# Altium project Jetson AGX Xavier Carrier Board.PrjPcb (part 8 of 8)
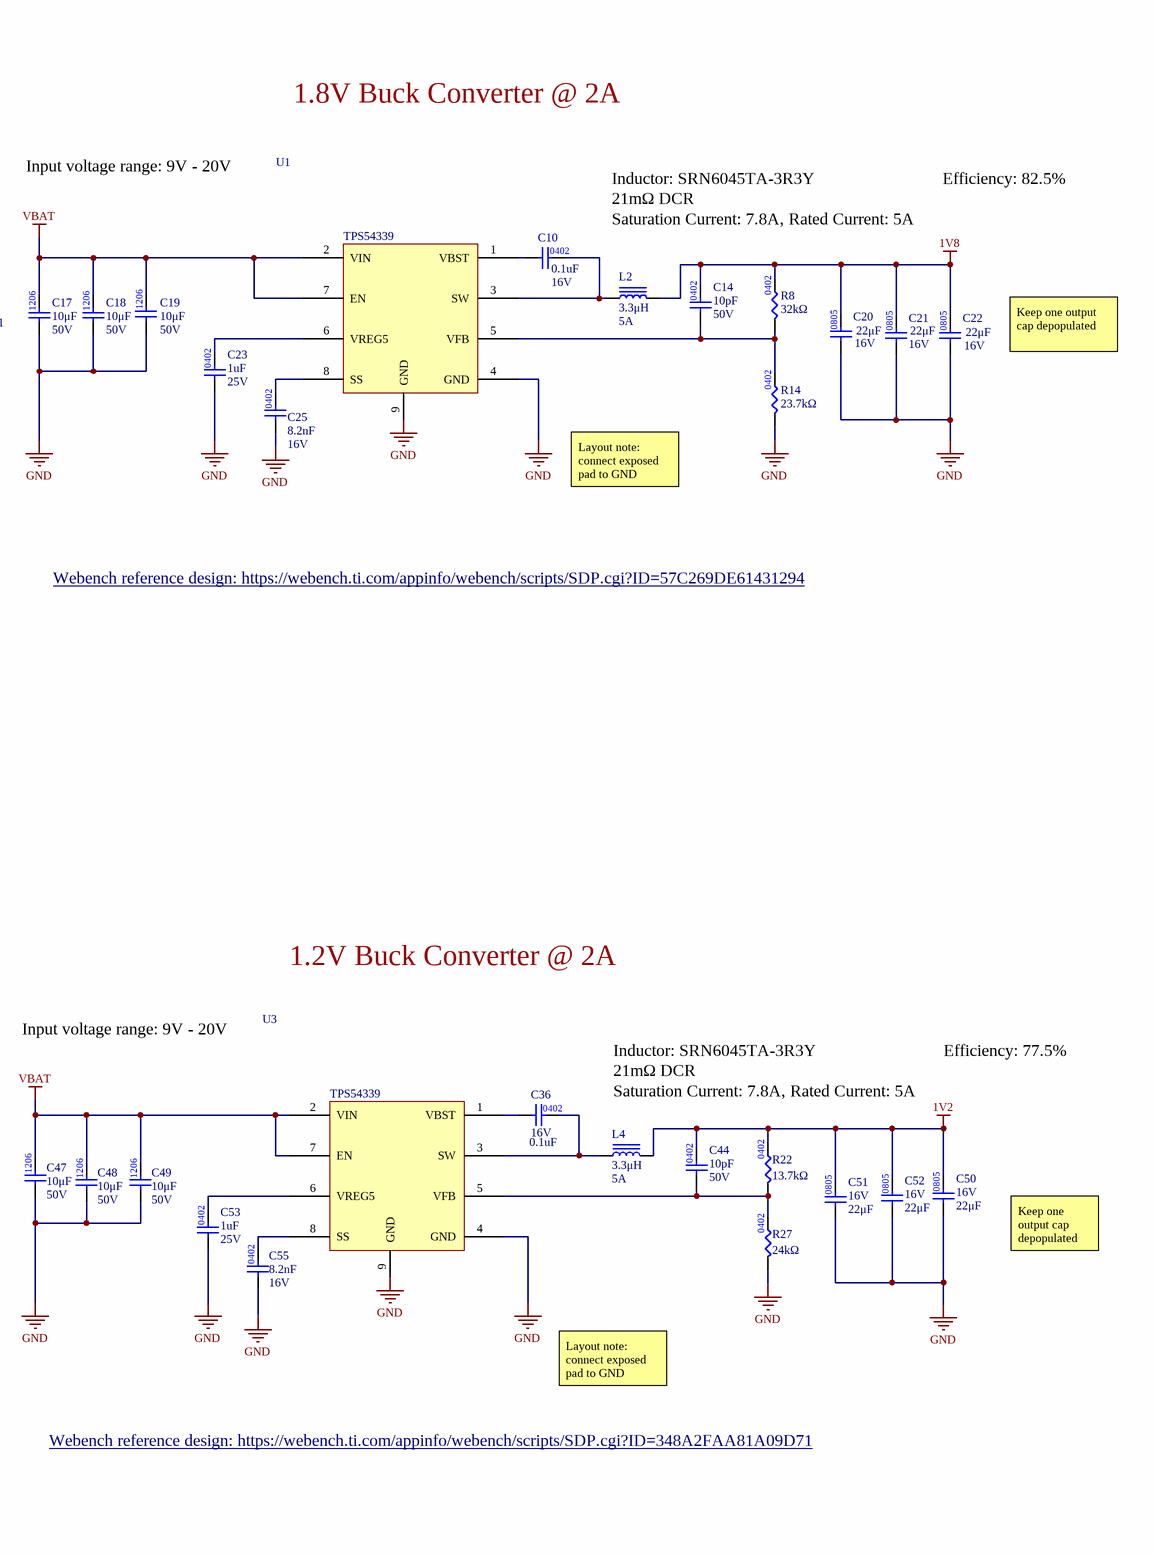
[diagram p25: BUCK CONVERTERS.SchDoc, right]

## Nets that join several sheets
1V2: USB (19 pins), PCIe ETHERNET (20 pins), BUCK CONVERTERS (6 pins)
1V8: HDMI (Q14.1 R75.2), JTAG (6 pins), M.2 E-KEY (16 pins), M.2 M-KEY (R141.2 R142.2), GPIO AND SERIAL (21 pins), System (R41.2), Debug UART (6 pins), BUCK CONVERTERS (6 pins)
3V3: HDMI (9 pins), USB (13 pins), U_USB/U_USB_PORT_STACKED (R53_U_USB_U_USB_PORT_STACKED#1.2 R55_U_USB_U_USB_PORT_STACKED#1.2), U_USB/U_USB_PORT_ STACKED (R53_U_USB_PORT__STACKED.2 R55_U_USB_PORT__STACKED.2), U_USB/U_USB_PORT_STACKED (R53_U_USB_U_USB_PORT_STACKED#2.2 R55_U_USB_U_USB_PORT_STACKED#2.2), PCIe ETHERNET (19 pins), M.2 E-KEY (16 pins), M.2 M-KEY (16 pins), GPIO AND SERIAL (18 pins), CAN (C263.1 C264.1 U24.3 U25.3), RGMII ETHERNET (26 pins), System (R40.2), Debug UART (R185.2 R186.2), BUCK CONVERTERS (10 pins)
5V: HDMI (C170.2 U8.5), U_USB/U_USB_PORT_STACKED (C158_U_USB_U_USB_PORT_STACKED#1.2 C166_U_USB_U_USB_PORT_STACKED#1.2 U6_U_USB_U_USB_PORT_STACKED#1.5 U7_U_USB_U_USB_PORT_STACKED#1.5), U_USB/U_USB_PORT_ STACKED (C158_U_USB_PORT__STACKED.2 C166_U_USB_PORT__STACKED.2 U6_U_USB_PORT__STACKED.5 U7_U_USB_PORT__STACKED.5), U_USB/U_USB_PORT_STACKED (C158_U_USB_U_USB_PORT_STACKED#2.2 C166_U_USB_U_USB_PORT_STACKED#2.2 U6_U_USB_U_USB_PORT_STACKED#2.5 U7_U_USB_U_USB_PORT_STACKED#2.5), GPIO AND SERIAL (J9.02 J9.04), JETSON AGX SYS-PWR-GND (14 pins), System (5 pins), BUCK CONVERTERS (10 pins)
5V_USB1: U_USB/U_USB_PORT_STACKED (5 pins), U_USB/U_USB_PORT_ STACKED (5 pins), U_USB/U_USB_PORT_STACKED (5 pins)
5V_USB2: U_USB/U_USB_PORT_STACKED (5 pins), U_USB/U_USB_PORT_ STACKED (5 pins), U_USB/U_USB_PORT_STACKED (5 pins)
FGND: USB (C157.2 R52.2), U_USB/U_USB_PORT_STACKED (J3_U_USB_U_USB_PORT_STACKED#1.S1 J3_U_USB_U_USB_PORT_STACKED#1.S2 J3_U_USB_U_USB_PORT_STACKED#1.S3 J3_U_USB_U_USB_PORT_STACKED#1.S4), U_USB/U_USB_PORT_ STACKED (J3_U_USB_PORT__STACKED.S1 J3_U_USB_PORT__STACKED.S2 J3_U_USB_PORT__STACKED.S3 J3_U_USB_PORT__STACKED.S4), U_USB/U_USB_PORT_STACKED (J3_U_USB_U_USB_PORT_STACKED#2.S1 J3_U_USB_U_USB_PORT_STACKED#2.S2 J3_U_USB_U_USB_PORT_STACKED#2.S3 J3_U_USB_U_USB_PORT_STACKED#2.S4), PCIe ETHERNET (C190.1 J5.SH1 J5.SH2 R87.1), RGMII ETHERNET (C215.1 J6.SH1 J6.SH2 R115.1)
GND: HDMI (20 pins), JTAG (8 pins), USB (30 pins), U_USB/U_USB_PORT_STACKED (14 pins), U_USB/U_USB_PORT_ STACKED (14 pins), U_USB/U_USB_PORT_STACKED (14 pins), PCIe ETHERNET (36 pins), M.2 E-KEY (29 pins), M.2 M-KEY (17 pins), GPIO AND SERIAL (29 pins), CAN (C263.2 C264.2 U24.2 U25.2), JETSON AGX DP-HDMI-USB-GBE (R37.1 R38.1 R39.1), JETSON AGX SYS-PWR-GND (260 pins), RGMII ETHERNET (36 pins), System (18 pins), Debug UART (18 pins), POWER CONNECTOR (C1.2 D2.2 J1.2 R2.1), BUCK CONVERTERS (71 pins)
VBAT: JETSON AGX SYS-PWR-GND (47 pins), POWER CONNECTOR (C1.1 D1.3 Q1.3 R1.2), BUCK CONVERTERS (21 pins)
NetC159_U_USB_PORT__STACKED_1: U_USB/U_USB_PORT_STACKED (C159_U_USB_U_USB_PORT_STACKED#1.1), U_USB/U_USB_PORT_ STACKED (C159_U_USB_PORT__STACKED.1), U_USB/U_USB_PORT_STACKED (C159_U_USB_U_USB_PORT_STACKED#2.1)
NetC160_U_USB_PORT__STACKED_1: U_USB/U_USB_PORT_STACKED (C160_U_USB_U_USB_PORT_STACKED#1.1), U_USB/U_USB_PORT_ STACKED (C160_U_USB_PORT__STACKED.1), U_USB/U_USB_PORT_STACKED (C160_U_USB_U_USB_PORT_STACKED#2.1)
NetC164_U_USB_PORT__STACKED_1: U_USB/U_USB_PORT_STACKED (C164_U_USB_U_USB_PORT_STACKED#1.1), U_USB/U_USB_PORT_ STACKED (C164_U_USB_PORT__STACKED.1), U_USB/U_USB_PORT_STACKED (C164_U_USB_U_USB_PORT_STACKED#2.1)
NetC165_U_USB_PORT__STACKED_1: U_USB/U_USB_PORT_STACKED (C165_U_USB_U_USB_PORT_STACKED#1.1), U_USB/U_USB_PORT_ STACKED (C165_U_USB_PORT__STACKED.1), U_USB/U_USB_PORT_STACKED (C165_U_USB_U_USB_PORT_STACKED#2.1)
NetP1_A53: GPIO AND SERIAL (R176.1), JETSON AGX CSI-I2C-I2S (P1.A53)
NetP1_C53: GPIO AND SERIAL (R177.1), JETSON AGX CSI-I2C-I2S (P1.C53)
NetR54_U_USB_PORT__STACKED_1: U_USB/U_USB_PORT_STACKED (R54_U_USB_U_USB_PORT_STACKED#1.1), U_USB/U_USB_PORT_ STACKED (R54_U_USB_PORT__STACKED.1), U_USB/U_USB_PORT_STACKED (R54_U_USB_U_USB_PORT_STACKED#2.1)
NetR56_U_USB_PORT__STACKED_1: U_USB/U_USB_PORT_STACKED (R56_U_USB_U_USB_PORT_STACKED#1.1), U_USB/U_USB_PORT_ STACKED (R56_U_USB_PORT__STACKED.1), U_USB/U_USB_PORT_STACKED (R56_U_USB_U_USB_PORT_STACKED#2.1)
NV_CAN0.DATA_IN: CAN (U24.4), JETSON AGX SDIO-SPI-UART-CAN-GPIO (P1.F58)
NV_CAN0.DATA_OUT: CAN (U24.1), JETSON AGX SDIO-SPI-UART-CAN-GPIO (P1.D59)
NV_CAN1.DATA_IN: CAN (U25.4), JETSON AGX SDIO-SPI-UART-CAN-GPIO (P1.B61)
NV_CAN1.DATA_OUT: CAN (U25.1), JETSON AGX SDIO-SPI-UART-CAN-GPIO (P1.H61)
NV_DP2.AUX_P: HDMI (Q12.2 Q13.2 R71.1 R73.1), JETSON AGX DP-HDMI-USB-GBE (P1.G53)
NV_DP2.HPD: HDMI (Q14.2 R75.1), JETSON AGX DP-HDMI-USB-GBE (P1.K50 R39.2)
NV_DP2.TX0_N: HDMI (C176.1), JETSON AGX DP-HDMI-USB-GBE (P1.D52)
NV_DP2.TX0_P: HDMI (C175.1), JETSON AGX DP-HDMI-USB-GBE (P1.D51)
NV_DP2.TX1_N: HDMI (C178.1), JETSON AGX DP-HDMI-USB-GBE (P1.B52)
NV_DP2.TX1_P: HDMI (C177.1), JETSON AGX DP-HDMI-USB-GBE (P1.B51)
NV_DP2.TX2_N: HDMI (C180.1), JETSON AGX DP-HDMI-USB-GBE (P1.A50)
NV_DP2.TX2_P: HDMI (C179.1), JETSON AGX DP-HDMI-USB-GBE (P1.A51)
NV_DP2.TX3_N: HDMI (C182.1), JETSON AGX DP-HDMI-USB-GBE (P1.C50)
NV_DP2.TX3_P: HDMI (C181.1), JETSON AGX DP-HDMI-USB-GBE (P1.C51)
NV_FAN.PWM: JETSON AGX SYS-PWR-GND (P1.K62), System (R45.1)
NV_FAN.TACH: JETSON AGX SYS-PWR-GND (P1.E54), System (C135.2 J2.3 R41.1)
NV_HDMI_CEC: HDMI (D12.2 Q10.2 R57.1), JETSON AGX DP-HDMI-USB-GBE (P1.J50)
NV_I2C2.CLK: M.2 E-KEY (J7.60), GPIO AND SERIAL (R174.1), JETSON AGX CSI-I2C-I2S (P1.J61)
NV_I2C2.DATA: M.2 E-KEY (J7.58 R134.1 R135.1), GPIO AND SERIAL (R175.1), JETSON AGX CSI-I2C-I2S (P1.K61)
NV_I2C4.CLK: M.2 M-KEY (J8.40 R141.1), JETSON AGX CSI-I2C-I2S (P1.D61)
NV_I2C4.DATA: M.2 M-KEY (J8.42 R142.1), JETSON AGX CSI-I2C-I2S (P1.E60)
NV_I2S2.CLK: GPIO AND SERIAL (U19.2), JETSON AGX CSI-I2C-I2S (P1.C59)
NV_I2S2.DATA_IN: GPIO AND SERIAL (U19.4), JETSON AGX CSI-I2C-I2S (P1.J59)
NV_I2S2.DATA_OUT: GPIO AND SERIAL (U19.3), JETSON AGX CSI-I2C-I2S (P1.K59)
NV_I2S2.FRAME_SYNC: GPIO AND SERIAL (U19.5), JETSON AGX CSI-I2C-I2S (P1.C60)
NV_JTAG.TCK: JTAG (J11.2 R192.1 R197.2), JETSON AGX SYS-PWR-GND (P1.A60)
NV_JTAG.TDI: JTAG (J11.6 R190.1 R195.2), JETSON AGX SYS-PWR-GND (P1.B60)
NV_JTAG.TDO: JTAG (J11.4 R191.1 R196.2), JETSON AGX SYS-PWR-GND (P1.D58)
NV_JTAG.TMS: JTAG (J11.10 R188.1 R193.2), JETSON AGX SYS-PWR-GND (P1.E58)
NV_JTAG.TRST_N: JTAG (J11.8 R189.1 R194.2), JETSON AGX SYS-PWR-GND (P1.G61)
NV_MOD_PRSNT.PRSNT_OUT: JETSON AGX SYS-PWR-GND (P1.L63), System (R40.1 S1.3 S1.4)
NV_PCIE_CTRL0.CLK_N: M.2 M-KEY (R162.1), JETSON AGX PCIE (P1.E14)
NV_PCIE_CTRL0.CLK_P: M.2 M-KEY (R161.1), JETSON AGX PCIE (P1.E15)
NV_PCIE_CTRL0.CLKREQ_N: M.2 M-KEY (R166.1), JETSON AGX PCIE (P1.E11)
NV_PCIE_CTRL0.RST_N: M.2 M-KEY (R165.1), JETSON AGX PCIE (P1.D10)
NV_PCIE_CTRL2.CLK_N: PCIe ETHERNET (U9.26), JETSON AGX PCIE (P1.E18)
NV_PCIE_CTRL2.CLK_P: PCIe ETHERNET (U9.25), JETSON AGX PCIE (P1.E19)
NV_PCIE_CTRL2.CLKREQ_N: PCIe ETHERNET (R81.1), JETSON AGX PCIE (P1.J11)
NV_PCIE_CTRL2.RST_N: PCIe ETHERNET (R82.1), JETSON AGX PCIE (P1.K10)
NV_PCIE_CTRL3.CLK_N: M.2 E-KEY (J7.49), JETSON AGX PCIE (P1.F21)
NV_PCIE_CTRL3.CLK_P: M.2 E-KEY (J7.47), JETSON AGX PCIE (P1.F20)
NV_PCIE_CTRL3.CLKREQ_N: M.2 E-KEY (J7.53), JETSON AGX PCIE (P1.J10)
NV_PCIE_CTRL3.RST_N: M.2 E-KEY (J7.52 R133.1), JETSON AGX PCIE (P1.K9)
NV_PCIE_WAKE_N: PCIe ETHERNET (R83.1), M.2 E-KEY (J7.55 R137.1), M.2 M-KEY (R146.2), JETSON AGX PCIE (P1.A8)
NV_RGMII.INT_N: JETSON AGX DP-HDMI-USB-GBE (P1.J5), RGMII ETHERNET (R108.1)
NV_RGMII.MDC: JETSON AGX DP-HDMI-USB-GBE (P1.E6), RGMII ETHERNET (R109.1)
NV_RGMII.MDIO: JETSON AGX DP-HDMI-USB-GBE (P1.E7), RGMII ETHERNET (R111.1)
NV_RGMII.RST_N: JETSON AGX DP-HDMI-USB-GBE (P1.H5), RGMII ETHERNET (R107.1)
NV_RGMII.RX_CLK: JETSON AGX DP-HDMI-USB-GBE (P1.C5), RGMII ETHERNET (R101.1)
NV_RGMII.RX_DATA0: JETSON AGX DP-HDMI-USB-GBE (P1.C4), RGMII ETHERNET (R102.1)
NV_RGMII.RX_DATA1: JETSON AGX DP-HDMI-USB-GBE (P1.K6), RGMII ETHERNET (R103.1)
NV_RGMII.RX_DATA2: JETSON AGX DP-HDMI-USB-GBE (P1.H6), RGMII ETHERNET (R104.1)
NV_RGMII.RX_DATA3: JETSON AGX DP-HDMI-USB-GBE (P1.E5), RGMII ETHERNET (R105.1)
NV_RGMII.RX_EN: JETSON AGX DP-HDMI-USB-GBE (P1.D5), RGMII ETHERNET (R106.1)
NV_RGMII.TX_CLK: JETSON AGX DP-HDMI-USB-GBE (P1.B5), RGMII ETHERNET (R95.1)
NV_RGMII.TX_DATA0: JETSON AGX DP-HDMI-USB-GBE (P1.J6), RGMII ETHERNET (R96.1)
NV_RGMII.TX_DATA1: JETSON AGX DP-HDMI-USB-GBE (P1.G5), RGMII ETHERNET (R97.1)
NV_RGMII.TX_DATA2: JETSON AGX DP-HDMI-USB-GBE (P1.J7), RGMII ETHERNET (R98.1)
NV_RGMII.TX_DATA3: JETSON AGX DP-HDMI-USB-GBE (P1.G6), RGMII ETHERNET (R99.1)
NV_RGMII.TX_EN: JETSON AGX DP-HDMI-USB-GBE (P1.K7), RGMII ETHERNET (R100.1)
NV_SPI1.CLK: GPIO AND SERIAL (U22.4), JETSON AGX SDIO-SPI-UART-CAN-GPIO (P1.J57)
NV_SPI1.CS0_N: GPIO AND SERIAL (U22.5), JETSON AGX SDIO-SPI-UART-CAN-GPIO (P1.E55)
NV_SPI1.CS1_N: GPIO AND SERIAL (U23.2), JETSON AGX SDIO-SPI-UART-CAN-GPIO (P1.B56)
NV_SPI1.MISO: GPIO AND SERIAL (U22.3), JETSON AGX SDIO-SPI-UART-CAN-GPIO (P1.A56)
NV_SPI1.MOSI: GPIO AND SERIAL (U22.2), JETSON AGX SDIO-SPI-UART-CAN-GPIO (P1.D55)
NV_SYS.FORCE_RECOV_N: JETSON AGX SYS-PWR-GND (P1.L10), System (8 pins)
NV_SYS.PWR_BTN_N: JETSON AGX SYS-PWR-GND (P1.L61), System (D9.1 D9.2)
NV_UART1.CTS: GPIO AND SERIAL (U18.4), JETSON AGX SDIO-SPI-UART-CAN-GPIO (P1.H54)
NV_UART1.RTS: GPIO AND SERIAL (U18.2), JETSON AGX SDIO-SPI-UART-CAN-GPIO (P1.L51)
NV_UART1.RX: GPIO AND SERIAL (U18.5), JETSON AGX SDIO-SPI-UART-CAN-GPIO (P1.K54)
NV_UART1.TX: GPIO AND SERIAL (U18.3), JETSON AGX SDIO-SPI-UART-CAN-GPIO (P1.K53)
NV_UART3_DEBUG.RX: JETSON AGX SDIO-SPI-UART-CAN-GPIO (P1.K60), Debug UART (U27.3)
NV_UART3_DEBUG.TX: JETSON AGX SDIO-SPI-UART-CAN-GPIO (P1.H62), Debug UART (U27.2)
NV_UART5.RTS: M.2 E-KEY (U16.2), JETSON AGX SDIO-SPI-UART-CAN-GPIO (P1.K58)
NV_UART5.RX: M.2 E-KEY (J7.22), JETSON AGX SDIO-SPI-UART-CAN-GPIO (P1.H58)
NV_UART5.TX: M.2 E-KEY (U15.2), JETSON AGX SDIO-SPI-UART-CAN-GPIO (P1.J58)
NV_UART.CTS: M.2 E-KEY (J7.34), JETSON AGX SDIO-SPI-UART-CAN-GPIO (P1.H57)
NV_UPHY2.RX_N: M.2 M-KEY (R157.1), JETSON AGX UPHY (P1.B20)
NV_UPHY2.RX_P: M.2 M-KEY (R158.1), JETSON AGX UPHY (P1.B21)
NV_UPHY2.TX_N: M.2 M-KEY (R159.1), JETSON AGX UPHY (C110.2)
NV_UPHY2.TX_P: M.2 M-KEY (R160.1), JETSON AGX UPHY (C109.2)
NV_UPHY3.RX_N: M.2 M-KEY (R153.1), JETSON AGX UPHY (P1.D21)
NV_UPHY3.RX_P: M.2 M-KEY (R154.1), JETSON AGX UPHY (P1.D20)
NV_UPHY3.TX_N: M.2 M-KEY (R155.1), JETSON AGX UPHY (C112.2)
NV_UPHY3.TX_P: M.2 M-KEY (R156.1), JETSON AGX UPHY (C111.2)
NV_UPHY4.RX_N: M.2 M-KEY (R149.1), JETSON AGX UPHY (P1.A19)
NV_UPHY4.RX_P: M.2 M-KEY (R150.1), JETSON AGX UPHY (P1.A18)
NV_UPHY4.TX_N: M.2 M-KEY (R151.1), JETSON AGX UPHY (C114.2)
NV_UPHY4.TX_P: M.2 M-KEY (R152.1), JETSON AGX UPHY (C113.2)
NV_UPHY5.RX_N: M.2 M-KEY (R143.1), JETSON AGX UPHY (P1.C18)
NV_UPHY5.RX_P: M.2 M-KEY (R145.1), JETSON AGX UPHY (P1.C19)
NV_UPHY5.TX_N: M.2 M-KEY (R147.1), JETSON AGX UPHY (C116.2)
NV_UPHY5.TX_P: M.2 M-KEY (R148.1), JETSON AGX UPHY (C115.2)
NV_UPHY7.RX_N: M.2 E-KEY (J7.43), JETSON AGX UPHY (P1.D17)
NV_UPHY7.RX_P: M.2 E-KEY (J7.41), JETSON AGX UPHY (P1.D16)
NV_UPHY7.TX_N: M.2 E-KEY (J7.37), JETSON AGX UPHY (C120.2)
NV_UPHY7.TX_P: M.2 E-KEY (J7.35), JETSON AGX UPHY (C119.2)
NV_UPHY8.RX_N: PCIe ETHERNET (C184.1), JETSON AGX UPHY (P1.A14)
NV_UPHY8.RX_P: PCIe ETHERNET (C183.1), JETSON AGX UPHY (P1.A15)
NV_UPHY8.TX_N: PCIe ETHERNET (U9.17), JETSON AGX UPHY (C122.2)
NV_UPHY8.TX_P: PCIe ETHERNET (U9.16), JETSON AGX UPHY (C121.2)
NV_USB2.DATA_N: M.2 E-KEY (J7.5), JETSON AGX DP-HDMI-USB-GBE (P1.A11)
NV_USB2.DATA_P: M.2 E-KEY (J7.3), JETSON AGX DP-HDMI-USB-GBE (P1.A10)
USB2_1.DATA_N: U_USB/U_USB_PORT_STACKED (J3_U_USB_U_USB_PORT_STACKED#1.2), U_USB/U_USB_PORT_ STACKED (J3_U_USB_PORT__STACKED.2), U_USB/U_USB_PORT_STACKED (J3_U_USB_U_USB_PORT_STACKED#2.2)
USB2_1.DATA_P: U_USB/U_USB_PORT_STACKED (J3_U_USB_U_USB_PORT_STACKED#1.3), U_USB/U_USB_PORT_ STACKED (J3_U_USB_PORT__STACKED.3), U_USB/U_USB_PORT_STACKED (J3_U_USB_U_USB_PORT_STACKED#2.3)
USB2_2.DATA_N: U_USB/U_USB_PORT_STACKED (J3_U_USB_U_USB_PORT_STACKED#1.11), U_USB/U_USB_PORT_ STACKED (J3_U_USB_PORT__STACKED.11), U_USB/U_USB_PORT_STACKED (J3_U_USB_U_USB_PORT_STACKED#2.11)
USB2_2.DATA_P: U_USB/U_USB_PORT_STACKED (J3_U_USB_U_USB_PORT_STACKED#1.12), U_USB/U_USB_PORT_ STACKED (J3_U_USB_PORT__STACKED.12), U_USB/U_USB_PORT_STACKED (J3_U_USB_U_USB_PORT_STACKED#2.12)
USB3_1.RX_N: U_USB/U_USB_PORT_STACKED (J3_U_USB_U_USB_PORT_STACKED#1.5), U_USB/U_USB_PORT_ STACKED (J3_U_USB_PORT__STACKED.5), U_USB/U_USB_PORT_STACKED (J3_U_USB_U_USB_PORT_STACKED#2.5)
USB3_1.RX_P: U_USB/U_USB_PORT_STACKED (J3_U_USB_U_USB_PORT_STACKED#1.6), U_USB/U_USB_PORT_ STACKED (J3_U_USB_PORT__STACKED.6), U_USB/U_USB_PORT_STACKED (J3_U_USB_U_USB_PORT_STACKED#2.6)
USB3_1.TX_N: U_USB/U_USB_PORT_STACKED (C159_U_USB_U_USB_PORT_STACKED#1.2 J3_U_USB_U_USB_PORT_STACKED#1.8), U_USB/U_USB_PORT_ STACKED (C159_U_USB_PORT__STACKED.2 J3_U_USB_PORT__STACKED.8), U_USB/U_USB_PORT_STACKED (C159_U_USB_U_USB_PORT_STACKED#2.2 J3_U_USB_U_USB_PORT_STACKED#2.8)
USB3_1.TX_P: U_USB/U_USB_PORT_STACKED (C160_U_USB_U_USB_PORT_STACKED#1.2 J3_U_USB_U_USB_PORT_STACKED#1.9), U_USB/U_USB_PORT_ STACKED (C160_U_USB_PORT__STACKED.2 J3_U_USB_PORT__STACKED.9), U_USB/U_USB_PORT_STACKED (C160_U_USB_U_USB_PORT_STACKED#2.2 J3_U_USB_U_USB_PORT_STACKED#2.9)
USB3_2.RX_N: U_USB/U_USB_PORT_STACKED (J3_U_USB_U_USB_PORT_STACKED#1.14), U_USB/U_USB_PORT_ STACKED (J3_U_USB_PORT__STACKED.14), U_USB/U_USB_PORT_STACKED (J3_U_USB_U_USB_PORT_STACKED#2.14)
USB3_2.RX_P: U_USB/U_USB_PORT_STACKED (J3_U_USB_U_USB_PORT_STACKED#1.15), U_USB/U_USB_PORT_ STACKED (J3_U_USB_PORT__STACKED.15), U_USB/U_USB_PORT_STACKED (J3_U_USB_U_USB_PORT_STACKED#2.15)
USB3_2.TX_N: U_USB/U_USB_PORT_STACKED (C164_U_USB_U_USB_PORT_STACKED#1.2 J3_U_USB_U_USB_PORT_STACKED#1.17), U_USB/U_USB_PORT_ STACKED (C164_U_USB_PORT__STACKED.2 J3_U_USB_PORT__STACKED.17), U_USB/U_USB_PORT_STACKED (C164_U_USB_U_USB_PORT_STACKED#2.2 J3_U_USB_U_USB_PORT_STACKED#2.17)
USB3_2.TX_P: U_USB/U_USB_PORT_STACKED (C165_U_USB_U_USB_PORT_STACKED#1.2 J3_U_USB_U_USB_PORT_STACKED#1.18), U_USB/U_USB_PORT_ STACKED (C165_U_USB_PORT__STACKED.2 J3_U_USB_PORT__STACKED.18), U_USB/U_USB_PORT_STACKED (C165_U_USB_U_USB_PORT_STACKED#2.2 J3_U_USB_U_USB_PORT_STACKED#2.18)